# Altium project PCB_TCC.PrjPcb
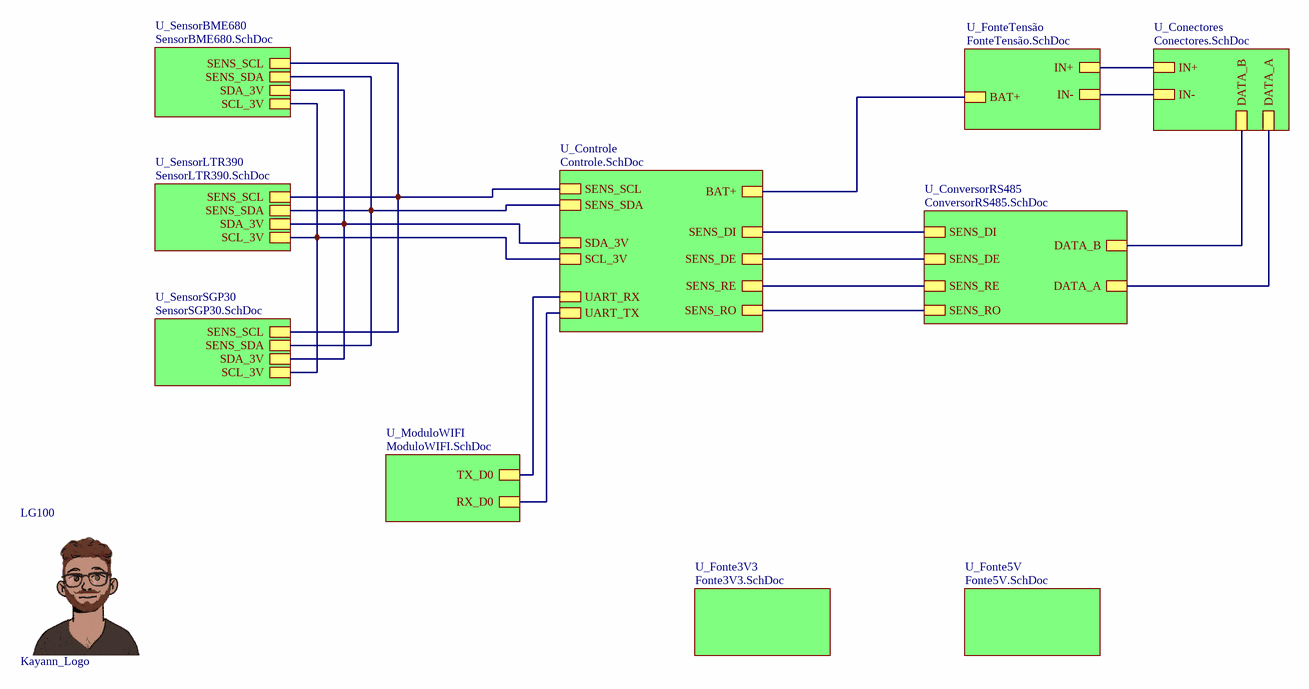
[diagram p0: AGRIsense.SchDoc]
CAGE_CODE: ?????; CONTRACT_NUMBER: <CONTRACT NO>; DOC_NO_ASSY_DWG: <ASSY DWG NO>; DOC_NO_BOM: <BOM DOC NO>; DOC_NO_FAB_DWG: <FAB DWG NO>; DOC_NO_SCH_DWG: <SCH DWG NO>; PCB_2_DEC_TOL: +/-.01; PCB_3_DEC_TOL: +/-.010; PCB_ANG_TOL: +/-1/2; PCB_ASSEMBLY_NO: <PCB ASSY NO>; PCB_CHECKER: - -----; PCB_CHECKER_APP_DATE: --/--/----; PCB_DESIGNER: - -----; PCB_DESIGNER_APP_DATE: --/--/----; PCB_DWG_NO: <PCB DWG NO>; PCB_ENGINEER: Kayann Soares; PCB_ENGINEER_APP_DATE: --/--/----; PCB_PART_NUMBER: <PCB PN>; PCB_REV: A; SCH_REV: A
11 sheets, 77 parts. Net scope: hierarchical (ports join the sheet entries above them; power ports are global).
Board file: PCB1.PcbDoc
Sheets:
  AGRIsense.SchDoc
    U_SensorSGP30 = SensorSGP30.SchDoc
    U_SensorLTR390 = SensorLTR390.SchDoc
    U_ModuloWIFI = ModuloWIFI.SchDoc
    U_Fonte3V3 = Fonte3V3.SchDoc
    U_Conectores = Conectores.SchDoc
    U_ConversorRS485 = ConversorRS485.SchDoc
    U_SensorBME680 = SensorBME680.SchDoc
    U_Fonte5V = Fonte5V.SchDoc
    U_Controle = Controle.SchDoc
    U_FonteTensão = FonteTensão.SchDoc

## Sheet AGRIsense.SchDoc
size A4; Engineer: Kayann Soares; SheetNumber: 1; SheetTotal: 11; CompanyInfo1: Universidade Federal do Ceará; CompanyInfo2: Centro de Tecnologia - CT; CompanyInfo3: Dep. de Eng. de Teleinformática

### Parts
LG100  Kayann_Logo  [Kayann_Logo]

### Sub-sheets
U_Conectores = Conectores.SchDoc: IN+, IN-, DATA_A, DATA_B
U_Controle = Controle.SchDoc: SENS_SCL, SENS_SDA, SDA_3V, SCL_3V, UART_RX, UART_TX, SENS_DI, SENS_DE, SENS_RE, SENS_RO, BAT+
U_ConversorRS485 = ConversorRS485.SchDoc: SENS_DI, SENS_DE, SENS_RE, SENS_RO, DATA_A, DATA_B
U_Fonte3V3 = Fonte3V3.SchDoc: no entries
U_Fonte5V = Fonte5V.SchDoc: no entries
U_FonteTensão = FonteTensão.SchDoc: IN+, IN-, BAT+
U_ModuloWIFI = ModuloWIFI.SchDoc: RX_D0, TX_D0
U_SensorBME680 = SensorBME680.SchDoc: SENS_SCL, SENS_SDA, SDA_3V, SCL_3V
U_SensorLTR390 = SensorLTR390.SchDoc: SENS_SCL, SENS_SDA, SDA_3V, SCL_3V
U_SensorSGP30 = SensorSGP30.SchDoc: SENS_SCL, SENS_SDA, SDA_3V, SCL_3V

### Nets
IN-: sheet U_Conectores/IN-, sheet U_FonteTensão/IN-
BAT+: sheet U_Controle/BAT+, sheet U_FonteTensão/BAT+
DATA_A: sheet U_Conectores/DATA_A, sheet U_ConversorRS485/DATA_A
DATA_B: sheet U_Conectores/DATA_B, sheet U_ConversorRS485/DATA_B
IN+: sheet U_Conectores/IN+, sheet U_FonteTensão/IN+
RX_D0: sheet U_ModuloWIFI/RX_D0, sheet U_Controle/UART_TX
SCL_3V: sheet U_SensorSGP30/SCL_3V, sheet U_SensorLTR390/SCL_3V, sheet U_SensorBME680/SCL_3V, sheet U_Controle/SCL_3V
SDA_3V: sheet U_SensorSGP30/SDA_3V, sheet U_SensorLTR390/SDA_3V, sheet U_SensorBME680/SDA_3V, sheet U_Controle/SDA_3V
SENS_DE: sheet U_ConversorRS485/SENS_DE, sheet U_Controle/SENS_DE
SENS_DI: sheet U_ConversorRS485/SENS_DI, sheet U_Controle/SENS_DI
SENS_RE: sheet U_ConversorRS485/SENS_RE, sheet U_Controle/SENS_RE
SENS_RO: sheet U_ConversorRS485/SENS_RO, sheet U_Controle/SENS_RO
SENS_SCL: sheet U_SensorSGP30/SENS_SCL, sheet U_SensorLTR390/SENS_SCL, sheet U_SensorBME680/SENS_SCL, sheet U_Controle/SENS_SCL
SENS_SDA: sheet U_SensorSGP30/SENS_SDA, sheet U_SensorLTR390/SENS_SDA, sheet U_SensorBME680/SENS_SDA, sheet U_Controle/SENS_SDA
TX_D0: sheet U_ModuloWIFI/TX_D0, sheet U_Controle/UART_RX

### Notes on the sheet
- Título:
- Padrão:
- Projeto:
- Eng. Responsável:
- A4
- Data:
- Versão:
- Folha:
- V1
- de
- Arquivo:

## Sheet SensorSGP30.SchDoc
size A4; Engineer: Kayann Soares; SheetNumber: 6; SheetTotal: 10; CompanyInfo1: Universidade Federal do Ceará; CompanyInfo2: Centro de Tecnologia - CT; CompanyInfo3: Dep. de Eng. de Teleinformática
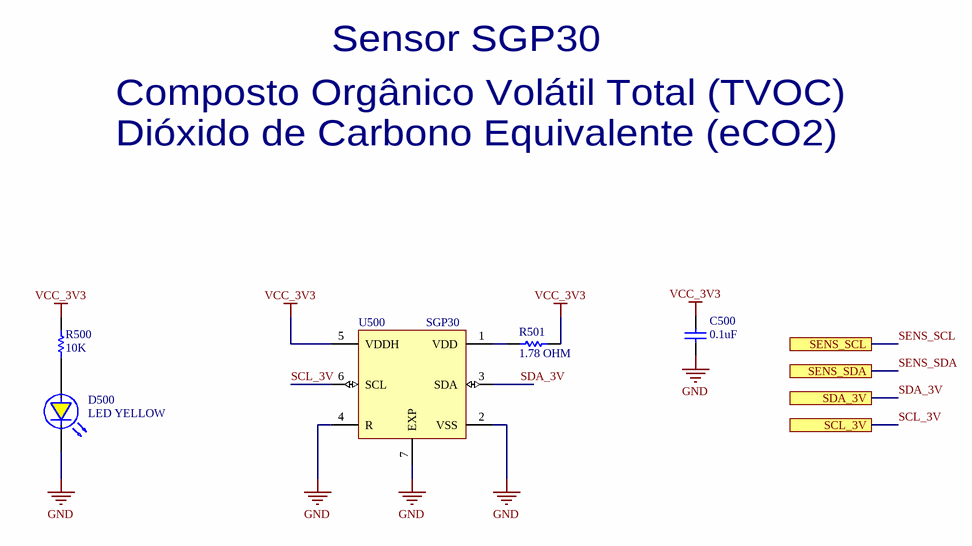
[diagram p1: SensorSGP30.SchDoc]

### Parts
C500  0.1uF  [CAP_CER_0603]
D500  LED YELLOW  [LED_YELLOW_SMD_0603]
R500  10K  [RES_0603]
R501  1.78 OHM  [RES_0603]
U500  SGP30  [SGP30]

### Ports
SCL_3V, SDA_3V, SENS_SCL, SENS_SDA

### Nets
GND: C500.1 D500.K U500.2(VSS) U500.4(R) U500.7(EXP)  [project net IN-]
VCC_3V3: C500.2 R500.2 R501.2 U500.5(VDDH)
SCL_3V: U500.6(SCL) ; port SCL_3V
SDA_3V: U500.3(SDA) ; port SDA_3V
NetD500_A: D500.A R500.1
NetR501_1: R501.1 U500.1(VDD)

### Notes on the sheet
- Sensor SGP30
- Composto Orgânico Volátil Total (TVOC)
- Dióxido de Carbono Equivalente (eCO2)
- Título:
- Padrão:
- Projeto:
- Eng. Responsável:
- A4
- Data:
- Versão:
- Folha:
- V1
- de
- Arquivo:

### Library data of the parts
C500 = CAP_CER_0.1uF_0603: Supplier 1: Digi-Key Marketplace; Supplier Part Number 1: 2571-GMC10X7R104J25NTTR-ND
D500 = LED_YELLOW_SMD_0603: Supplier 1: Digi-Key; Supplier Part Number 1: 754-1124-1-ND
R500 = RES_10K_0603: Supplier 1: Digi-Key Marketplace; Supplier Part Number 1: 2571-RM06J103CTTR-ND
R501 = RES_1.78OHM_0603: Supplier 1: Arrow Electronics; Supplier Part Number 1: RMCF0603FT1R78
U500 = SGP30: Supplier 1: Digi-Key; Supplier Part Number 1: 1649-1084-1-ND

## Sheet SensorLTR390.SchDoc
size A4; Engineer: Kayann Soares; SheetNumber: 5; SheetTotal: 10; CompanyInfo1: Universidade Federal do Ceará; CompanyInfo2: Centro de Tecnologia - CT; CompanyInfo3: Dep. de Eng. de Teleinformática
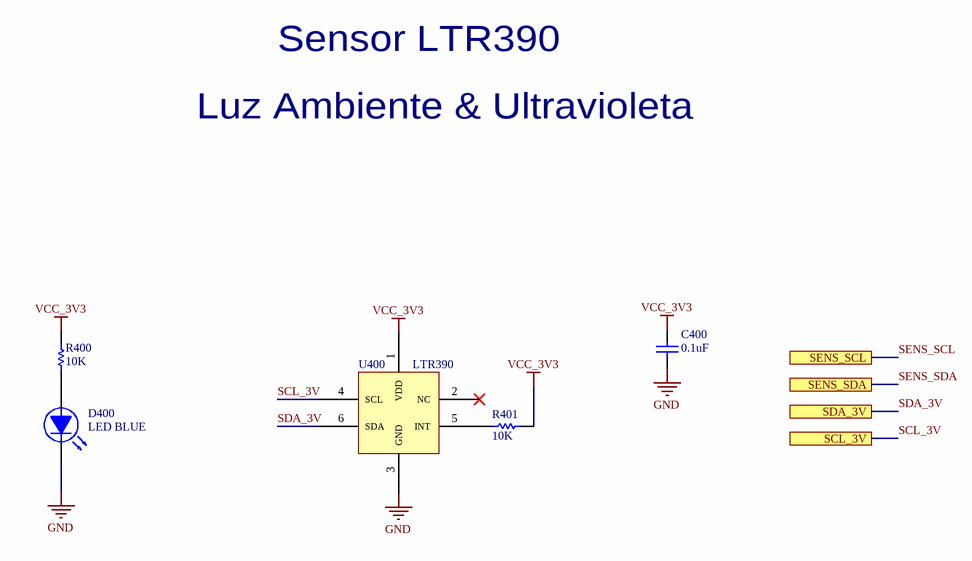
[diagram p2: SensorLTR390.SchDoc]

### Parts
C400  0.1uF  [CAP_CER_0603]
D400  LED BLUE  [LED_BLUE_SMD_0603]
R400  10K  [RES_0603]
R401  10K  [RES_0603]
U400  LTR390  [LTR390]

### Ports
SCL_3V, SDA_3V, SENS_SCL, SENS_SDA

### Nets
GND: C400.1 D400.K U400.3(GND)  [project net IN-]
VCC_3V3: C400.2 R400.2 R401.2 U400.1(VDD)
SCL_3V: U400.4(SCL) ; port SCL_3V
SDA_3V: U400.6(SDA) ; port SDA_3V
NetD400_A: D400.A R400.1
NetR401_1: R401.1 U400.5(INT)

Not connected (* = marked no-connect by the designer): U400 2(NC)*

### Notes on the sheet
- Sensor LTR390
- Luz Ambiente & Ultravioleta
- Título:
- Padrão:
- Projeto:
- Eng. Responsável:
- A4
- Data:
- Versão:
- Folha:
- V1
- de
- Arquivo:

### Library data of the parts
C400 = CAP_CER_0.1uF_0603: Supplier 1: Digi-Key Marketplace; Supplier Part Number 1: 2571-GMC10X7R104J25NTTR-ND
D400 = LED_BLUE_SMD_0603: ComponentLink1Description: New link; ComponentLink1URL: *; Supplier 1: Digi-Key; Supplier Part Number 1: 754-1434-1-ND
R400 R401 = RES_10K_0603: Supplier 1: Digi-Key Marketplace; Supplier Part Number 1: 2571-RM06J103CTTR-ND
U400 = LTR390: Supplier 1: Digi-Key; Supplier Part Number 1: LTR-390UV-01-ND

## Sheet ModuloWIFI.SchDoc
size A4; Engineer: Kayann Soares; SheetNumber: 3; SheetTotal: 11; CompanyInfo1: Universidade Federal do Ceará; CompanyInfo2: Centro de Tecnologia - CT; CompanyInfo3: Dep. de Eng. de Teleinformática
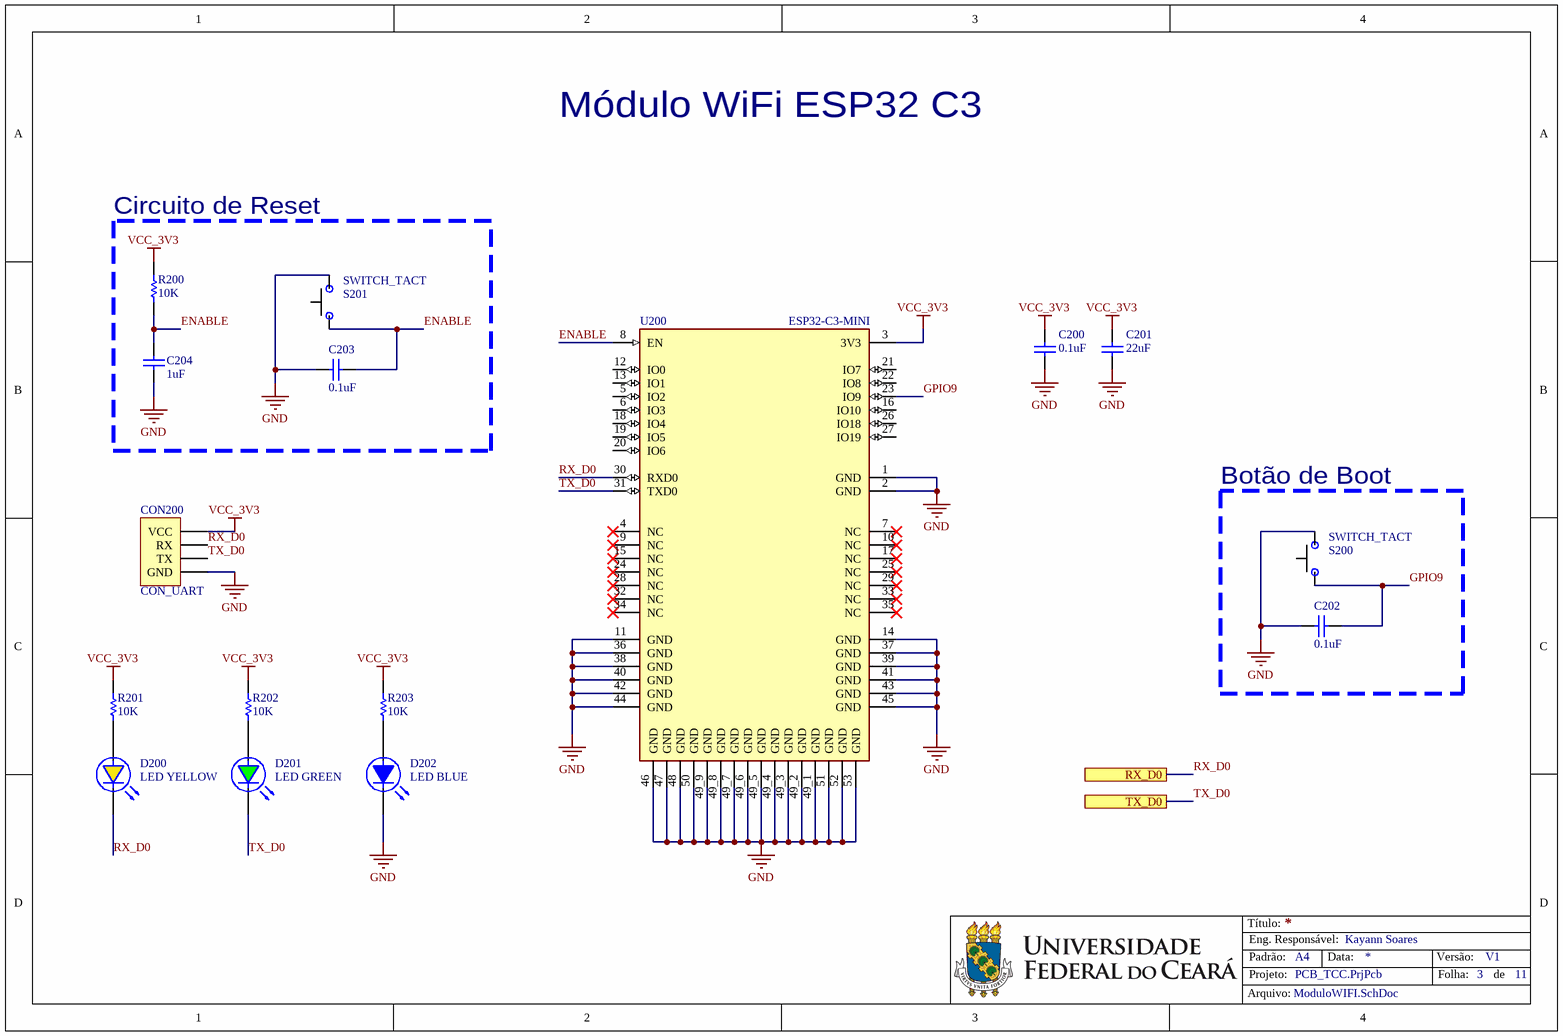
[diagram p3: ModuloWIFI.SchDoc]

### Parts
C200  0.1uF  [CAP_CER_0603]
C201  22uF  [CAP_CER_0603]
C202  0.1uF  [CAP_CER_0603]
C203  0.1uF  [CAP_CER_0603]
C204  1uF  [CAP_CER_0603]
CON200  CON_UART  [CON_UART]
D200  LED YELLOW  [LED_YELLOW_SMD_0603]
D201  LED GREEN  [LED_GREEN_SMD_0603]
D202  LED BLUE  [LED_BLUE_SMD_0603]
R200  10K  [RES_0603]
R201  10K  [RES_0603]
R202  10K  [RES_0603]
R203  10K  [RES_0603]
S200  SWITCH_TACT  [SWITCH_TACT_6.0x3.5]
S201  SWITCH_TACT  [SWITCH_TACT_6.0x3.5]
U200  ESP32-C3-MINI  [ESP32-C3-MINI]

### Blocks framed on the sheet
Botão de Boot: C202 S200

### Ports
RX_D0, TX_D0

### Nets
GND: C200.1 C201.1 C202.1 C203.1 C204.1 CON200.4(GND) D202.K S200.1 S201.1 U200.1(GND) U200.2(GND) U200.11(GND) U200.14(GND) U200.36(GND) U200.37(GND) U200.38(GND) U200.39(GND) U200.40(GND) U200.41(GND) U200.42(GND) U200.43(GND) U200.44(GND) U200.45(GND) U200.46(GND) U200.47(GND) U200.48(GND) U200.49_1(GND) U200.49_2(GND) U200.49_3(GND) U200.49_4(GND) U200.49_5(GND) U200.49_6(GND) U200.49_7(GND) U200.49_8(GND) U200.49_9(GND) U200.50(GND) U200.51(GND) U200.52(GND) U200.53(GND)  [project net IN-]
VCC_3V3: C200.2 C201.2 CON200.1(VCC) R200.2 R201.2 R202.2 R203.2 U200.3(3V3)
ENABLE: C203.2 C204.2 R200.1 S201.2 U200.8(EN)
GPIO9: C202.2 S200.2 U200.23(IO9)
RX_D0: CON200.2(RX) D200.K U200.30(RXD0) ; port RX_D0
TX_D0: CON200.3(TX) D201.K U200.31(TXD0) ; port TX_D0
NetD200_A: D200.A R201.1
NetD201_A: D201.A R202.1
NetD202_A: D202.A R203.1

Not connected (* = marked no-connect by the designer): U200 4(NC)* 5(IO2) 6(IO3) 7(NC)* 9(NC)* 10(NC)* 12(IO0) 13(IO1) 15(NC)* 16(IO10) 17(NC)* 18(IO4) 19(IO5) 20(IO6) 21(IO7) 22(IO8) 24(NC)* 25(NC)* 26(IO18) 27(IO19) 28(NC)* 29(NC)* 32(NC)* 33(NC)* 34(NC)* 35(NC)*

### Notes on the sheet
- Módulo WiFi ESP32 C3
- Circuito de Reset
- Título:
- Padrão:
- Projeto:
- Eng. Responsável:
- A4
- Data:
- Versão:
- Folha:
- V1
- de
- Arquivo:

### Library data of the parts
C200 C202 C203 = CAP_CER_0.1uF_0603: Supplier 1: Digi-Key Marketplace; Supplier Part Number 1: 2571-GMC10X7R104J25NTTR-ND
C201 = CAP_CER_22uF_0603: Supplier 1: Newark; Supplier Part Number 1: 03AC2653
C204 = CAP_CER_1uF_0603: Supplier 1: Arrow Electronics; Supplier Part Number 1: CL10B105KP8NNNC
D200 = LED_YELLOW_SMD_0603: Supplier 1: Digi-Key; Supplier Part Number 1: 754-1124-1-ND
D201 = LED_GREEN_SMD_0603: Supplier 1: Digi-Key; Supplier Part Number 1: 754-1121-1-ND
D202 = LED_BLUE_SMD_0603: ComponentLink1Description: New link; ComponentLink1URL: *; Supplier 1: Digi-Key; Supplier Part Number 1: 754-1434-1-ND
R200-R203 = RES_10K_0603: Supplier 1: Digi-Key Marketplace; Supplier Part Number 1: 2571-RM06J103CTTR-ND
S200 S201 = SWITCH_TACT_6.0x3.5: Supplier 1: Newark; Supplier Part Number 1: 35AH5169
U200 = ESP32-C3-MINI: Supplier 1: Mouser; Supplier Part Number 1: 356-ESP32-C3-MINI1H4

## Sheet Fonte3V3.SchDoc
size A4; Engineer: Kayann Soares; SheetNumber: 7; SheetTotal: 11; CompanyInfo1: Universidade Federal do Ceará; CompanyInfo2: Centro de Tecnologia - CT; CompanyInfo3: Dep. de Eng. de Teleinformática
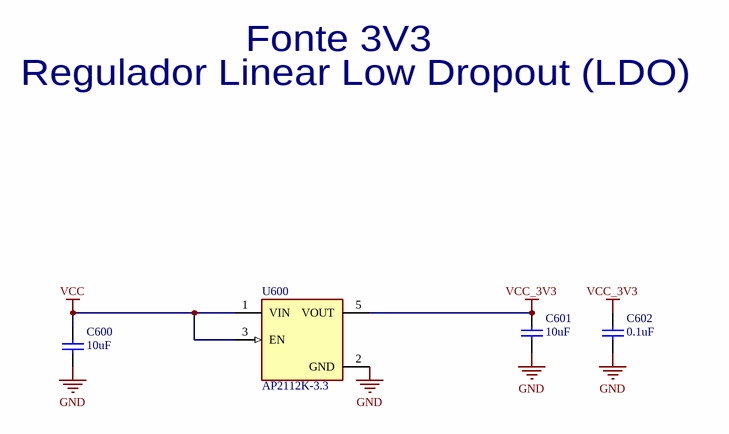
[diagram p4: Fonte3V3.SchDoc]

### Parts
C600  10uF  [CAP_CER_0805]
C601  10uF  [CAP_CER_0805]
C602  0.1uF  [CAP_CER_0603]
U600  AP2112K-3.3  [AP2112K-3.3]

### Nets
GND: C600.2 C601.2 C602.1 U600.2(GND)  [project net IN-]
VCC: C600.1 U600.1(VIN) U600.3(EN)
VCC_3V3: C601.1 C602.2 U600.5(VOUT)

### Notes on the sheet
- Fonte 3V3
- Regulador Linear Low Dropout (LDO)
- Título:
- Padrão:
- Projeto:
- Eng. Responsável:
- A4
- Data:
- Versão:
- Folha:
- V1
- de
- Arquivo:

### Library data of the parts
C600 C601 = CAP_CER_10uF_0805: Supplier 1: Arrow Electronics; Supplier Part Number 1: CL21A106KOQNNNE
C602 = CAP_CER_0.1uF_0603: Supplier 1: Digi-Key Marketplace; Supplier Part Number 1: 2571-GMC10X7R104J25NTTR-ND
U600 = AP2112K-3.3: Supplier 1: Future Electronics; Supplier Part Number 1: 8043011

## Sheet Conectores.SchDoc
size A4; Engineer: Kayann Soares; SheetNumber: 11; SheetTotal: 11; CompanyInfo1: Universidade Federal do Ceará; CompanyInfo2: Centro de Tecnologia - CT; CompanyInfo3: Dep. de Eng. de Teleinformática
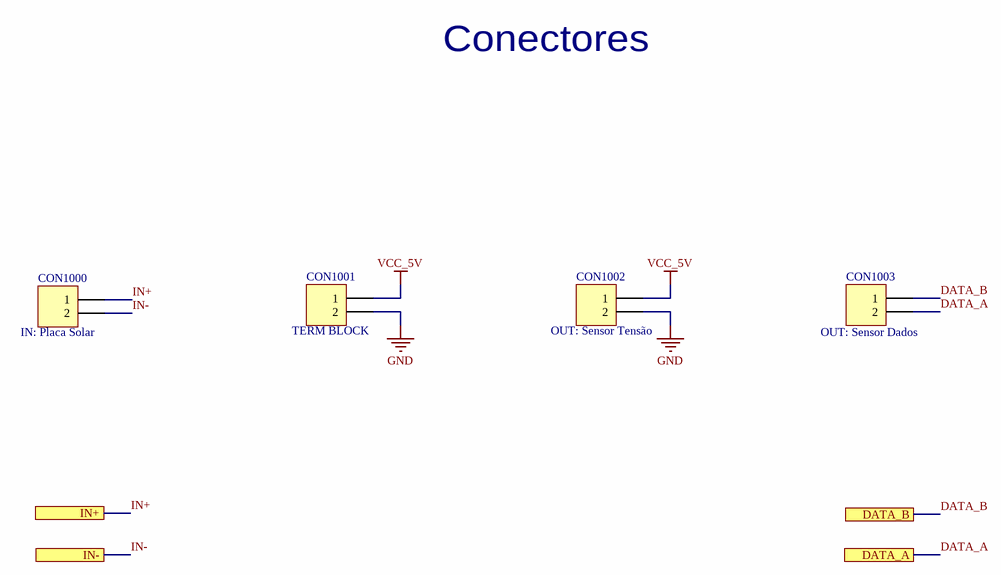
[diagram p5: Conectores.SchDoc]

### Parts
CON1000  IN: Placa Solar  [TERM BLOCK 2POS]
CON1001  TERM BLOCK  [TERM BLOCK 2POS]
CON1002  OUT: Sensor Tensão  [TERM BLOCK 2POS]
CON1003  OUT: Sensor Dados  [TERM BLOCK 2POS]

### Ports
DATA_A, DATA_B, IN+, IN-

### Nets
IN-: CON1000.2 CON1001.2 CON1002.2 ; port IN-  [also labelled GND]
VCC_5V: CON1001.1 CON1002.1
DATA_A: CON1003.2 ; port DATA_A
DATA_B: CON1003.1 ; port DATA_B
IN+: CON1000.1 ; port IN+

### Notes on the sheet
- Conectores
- Título:
- Padrão:
- Projeto:
- Eng. Responsável:
- A4
- Data:
- Versão:
- Folha:
- V1
- de
- Arquivo:

### Library data of the parts
CON1000-CON1003 = TERM BLOCK 2POS: Supplier 1: Newark; Supplier Part Number 1: 71C4161

## Sheet ConversorRS485.SchDoc
size A4; Engineer: Kayann Soares; SheetNumber: 10; SheetTotal: 11; CompanyInfo1: Universidade Federal do Ceará; CompanyInfo2: Centro de Tecnologia - CT; CompanyInfo3: Dep. de Eng. de Teleinformática
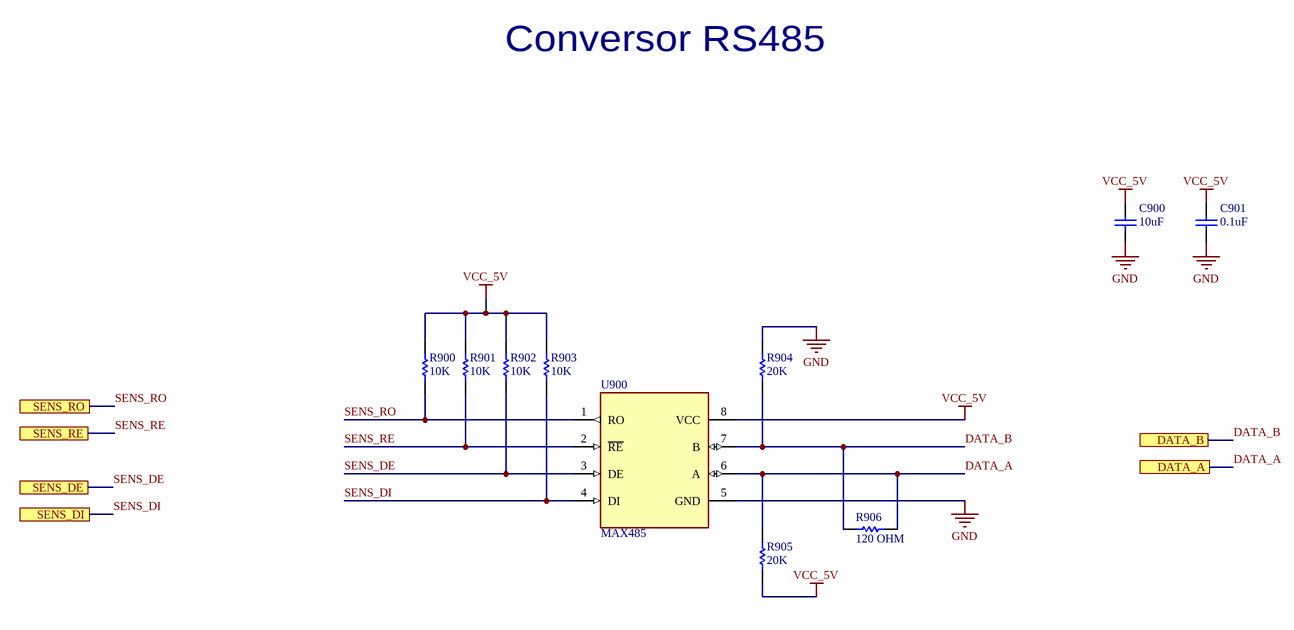
[diagram p6: ConversorRS485.SchDoc]

### Parts
C900  10uF  [CAP_CER_0805]
C901  0.1uF  [CAP_CER_0603]
R900  10K  [RES_0603]
R901  10K  [RES_0603]
R902  10K  [RES_0603]
R903  10K  [RES_0603]
R904  20K  [RES_0603]
R905  20K  [RES_0603]
R906  120 OHM  [RES_0603]
U900  MAX485  [MAX485]

### Ports
DATA_A, DATA_B, SENS_DE, SENS_DI, SENS_RE, SENS_RO

### Nets
GND: C900.2 C901.1 R904.2 U900.5(GND)  [project net IN-]
VCC_5V: C900.1 C901.2 R900.2 R901.2 R902.2 R903.2 R905.1 U900.8(VCC)
DATA_A: R905.2 R906.2 U900.6(A) ; port DATA_A
DATA_B: R904.1 R906.1 U900.7(B) ; port DATA_B
SENS_DE: R902.1 U900.3(DE) ; port SENS_DE
SENS_DI: R903.1 U900.4(DI) ; port SENS_DI
SENS_RE: R901.1 U900.2(~{RE}) ; port SENS_RE
SENS_RO: R900.1 U900.1(RO) ; port SENS_RO

### Notes on the sheet
- Conversor RS485
- Título:
- Padrão:
- Projeto:
- Eng. Responsável:
- A4
- Data:
- Versão:
- Folha:
- V1
- de
- Arquivo:

### Library data of the parts
C900 = CAP_CER_10uF_0805: Supplier 1: Arrow Electronics; Supplier Part Number 1: CL21A106KOQNNNE
C901 = CAP_CER_0.1uF_0603: Supplier 1: Digi-Key Marketplace; Supplier Part Number 1: 2571-GMC10X7R104J25NTTR-ND
R900-R903 = RES_10K_0603: Supplier 1: Digi-Key Marketplace; Supplier Part Number 1: 2571-RM06J103CTTR-ND
R904 R905 = RES_20K_0603: Supplier 1: Future Electronics; Supplier Part Number 1: 7472848
R906 = RES_120OHM_0603: Supplier 1: Future Electronics; Supplier Part Number 1: 7110726
U900 = MAX485: Supplier 1: Arrow Electronics; Supplier Part Number 1: MAX485ESA+T

## Sheet SensorBME680.SchDoc
size A4; Engineer: Kayann Soares; SheetNumber: 4; SheetTotal: 11; CompanyInfo1: Universidade Federal do Ceará; CompanyInfo2: Centro de Tecnologia - CT; CompanyInfo3: Dep. de Eng. de Teleinformática
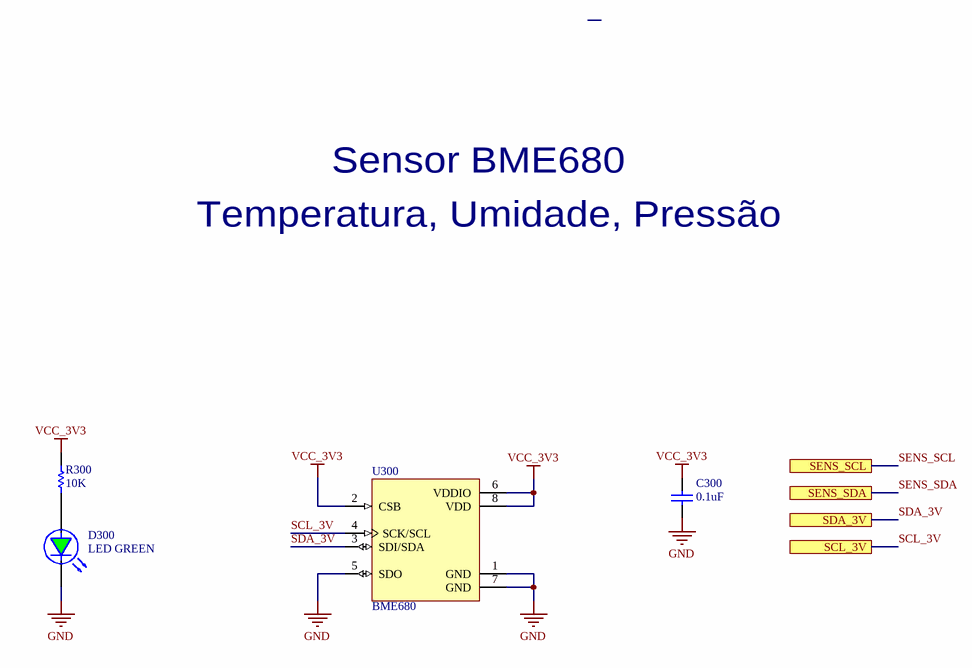
[diagram p7: SensorBME680.SchDoc]

### Parts
C300  0.1uF  [CAP_CER_0603]
D300  LED GREEN  [LED_GREEN_SMD_0603]
R300  10K  [RES_0603]
U300  BME680  [BME680]

### Ports
SCL_3V, SDA_3V, SENS_SCL, SENS_SDA

### Nets
GND: C300.1 D300.K U300.1(GND) U300.5(SDO) U300.7(GND)  [project net IN-]
VCC_3V3: C300.2 R300.2 U300.2(CSB) U300.6(VDDIO) U300.8(VDD)
SCL_3V: U300.4(SCK/SCL) ; port SCL_3V
SDA_3V: U300.3(SDI/SDA) ; port SDA_3V
NetD300_A: D300.A R300.1

### Notes on the sheet
- Sensor BME680
- Temperatura, Umidade, Pressão
- Título:
- Padrão:
- Projeto:
- Eng. Responsável:
- A4
- Data:
- Versão:
- Folha:
- V1
- de
- Arquivo:

### Library data of the parts
C300 = CAP_CER_0.1uF_0603: Supplier 1: Digi-Key Marketplace; Supplier Part Number 1: 2571-GMC10X7R104J25NTTR-ND
D300 = LED_GREEN_SMD_0603: Supplier 1: Digi-Key; Supplier Part Number 1: 754-1121-1-ND
R300 = RES_10K_0603: Supplier 1: Digi-Key Marketplace; Supplier Part Number 1: 2571-RM06J103CTTR-ND
U300 = BME680: Supplier 1: Digi-Key; Supplier Part Number 1: 828-1077-1-ND

## Sheet Fonte5V.SchDoc
size A4; Engineer: Kayann Soares; SheetNumber: 8; SheetTotal: 11; CompanyInfo1: Universidade Federal do Ceará; CompanyInfo2: Centro de Tecnologia - CT; CompanyInfo3: Dep. de Eng. de Teleinformática
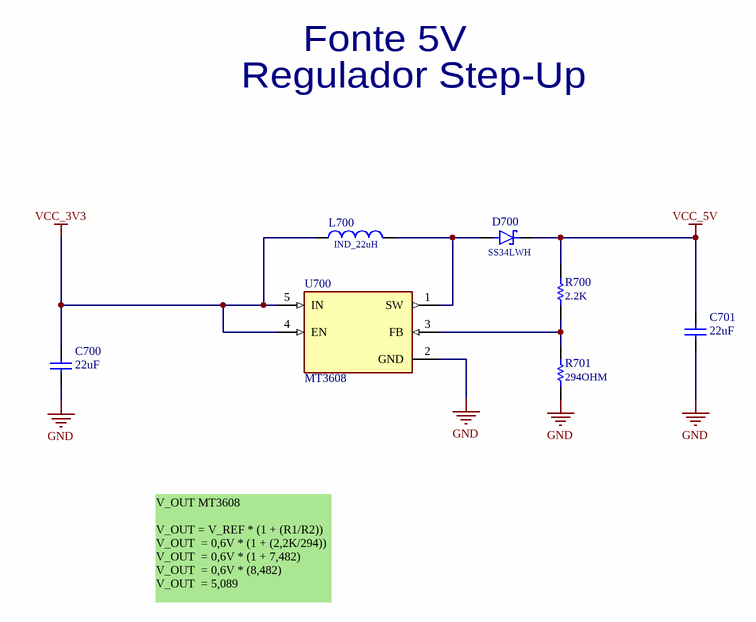
[diagram p8: Fonte5V.SchDoc]

### Parts
C700  22uF  [CAP_CER_0603]
C701  22uF  [CAP_CER_0603]
D700  SS34LWH  [DIODE_SS34LWH]
L700  IND_22uH  [FIXED_IND_22uH]
R700  2.2K  [RES_0603]
R701  294OHM
U700  MT3608  [MT3608]

### Nets
GND: C700.1 C701.1 R701.1 U700.2(GND)  [project net IN-]
VCC_3V3: C700.2 L700.1 U700.4(EN) U700.5(IN)
VCC_5V: C701.2 D700.C(K) R700.2
NetD700_A: D700.A L700.2 U700.1(SW)
NetR700_1: R700.1 R701.2 U700.3(FB)

### Notes on the sheet
- Fonte 5V
- Regulador Step-Up
- V_OUT MT3608
  V_OUT = V_REF * (1 + (R1/R2))
  V_OUT  = 0,6V * (1 + (2,2K/294))
  V_OUT  = 0,6V * (1 + 7,482)
  V_OUT  = 0,6V * (8,482)
  V_OUT  = 5,089
- Título:
- Padrão:
- Projeto:
- Eng. Responsável:
- A4
- Data:
- Versão:
- Folha:
- V1
- de
- Arquivo:

### Library data of the parts
C700 C701 = CAP_CER_22uF_0603: Supplier 1: Newark; Supplier Part Number 1: 03AC2653
D700 = DIODE_SS34LWH: Supplier 1: Mouser; Supplier Part Number 1: 821-SS34LWHRVG
L700 = FIXED_IND_22uH: Supplier 1: Newark; Supplier Part Number 1: 52K7553
R700 = RES_2.2K_0603: Supplier 1: Future Electronics; Supplier Part Number 1: 3379294
R701 = RES_294OHM_0603: Supplier 1: Future Electronics; Supplier Part Number 1: 1327384

## Sheet Controle.SchDoc
size A4; Engineer: Kayann Soares; SheetNumber: 2; SheetTotal: 11; CompanyInfo1: Universidade Federal do Ceará; CompanyInfo2: Centro de Tecnologia - CT; CompanyInfo3: Dep. de Eng. de Teleinformática
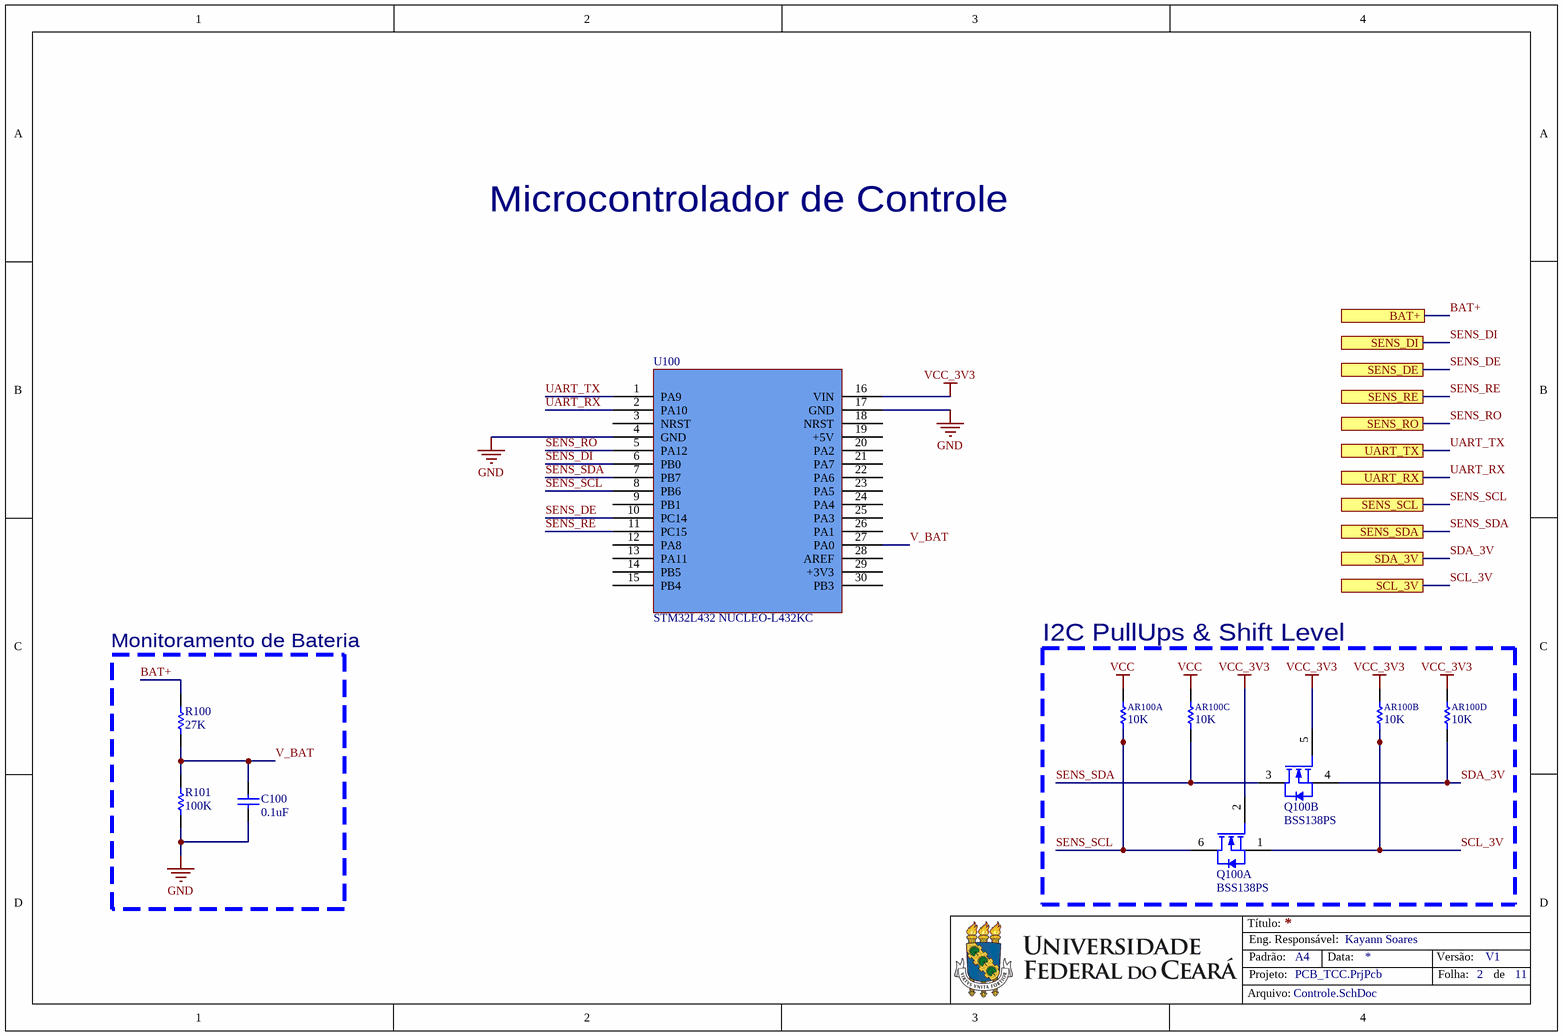
[diagram p9: Controle.SchDoc]

### Parts
AR100  10K  [RES_ARRAY _4RES_1206]  (parts A,B,C,D of 4)
C100  0.1uF  [CAP_CER_0603]
Q100  BSS138PS  [BSS138PS]  (parts A,B of 2)
R100  27K  [RES_0603]
R101  100K  [RES_0603]
U100  STM32L432 NUCLEO-L432KC  [STM32L432]

### Blocks framed on the sheet
Monitoramento de Bateria: C100 R100 R101
I2C PullUps & Shift Level: AR100 Q100

### Ports
BAT+, SCL_3V, SDA_3V, SENS_DE, SENS_DI, SENS_RE, SENS_RO, SENS_SCL, SENS_SDA, UART_RX, UART_TX

### Nets
GND: C100.1 R101.1 U100.4(GND) U100.17(GND)  [project net IN-]
VCC: AR100.6 AR100.8
VCC_3V3: AR100.5 AR100.7 Q100.2(G1) Q100.5(G2) U100.16(VIN)
BAT+: R100.2 ; port BAT+
SCL_3V: AR100.2 Q100.1(S1) ; port SCL_3V
SDA_3V: AR100.4 Q100.4(S2) ; port SDA_3V
SENS_DE: U100.10(PC14) ; port SENS_DE
SENS_DI: U100.6(PB0) ; port SENS_DI
SENS_RE: U100.11(PC15) ; port SENS_RE
SENS_RO: U100.5(PA12) ; port SENS_RO
SENS_SCL: AR100.1 Q100.6(D1) U100.8(PB6) ; port SENS_SCL
SENS_SDA: AR100.3 Q100.3(D2) U100.7(PB7) ; port SENS_SDA
UART_RX: U100.2(PA10) ; port UART_RX  [project net TX_D0]
UART_TX: U100.1(PA9) ; port UART_TX  [project net RX_D0]
V_BAT: C100.2 R100.1 R101.2 U100.27(PA0)

Not connected (* = marked no-connect by the designer): U100 3(NRST) 9(PB1) 12(PA8) 13(PA11) 14(PB5) 15(PB4) 18(NRST) 19(+5V) 20(PA2) 21(PA7) 22(PA6) 23(PA5) 24(PA4) 25(PA3) 26(PA1) 28(AREF) 29(+3V3) 30(PB3)

### Notes on the sheet
- Microcontrolador de Controle
- Título:
- Padrão:
- Projeto:
- Eng. Responsável:
- A4
- Data:
- Versão:
- Folha:
- V1
- de
- Arquivo:

### Library data of the parts
AR100 = RES_ARRAY_10K_1206: Supplier 1: Arrow Electronics; Supplier Part Number 1: CAY16-103J4LF
C100 = CAP_CER_0.1uF_0603: Supplier 1: Digi-Key Marketplace; Supplier Part Number 1: 2571-GMC10X7R104J25NTTR-ND
R100 = RES_27K_0603: Supplier 1: Future Electronics; Supplier Part Number 1: 6067715
R101 = RES_100K_0603: Supplier 1: Future Electronics; Supplier Part Number 1: 3697448
U100 = STM32L432
Q100 = BSS138PS: Supplier 1: Arrow Electronics; Supplier Part Number 1: BSS138PS,115

## Sheet FonteTensão.SchDoc
size A4; Engineer: Kayann Soares; SheetNumber: 9; SheetTotal: 11; CompanyInfo1: Universidade Federal do Ceará; CompanyInfo2: Centro de Tecnologia - CT; CompanyInfo3: Dep. de Eng. de Teleinformática
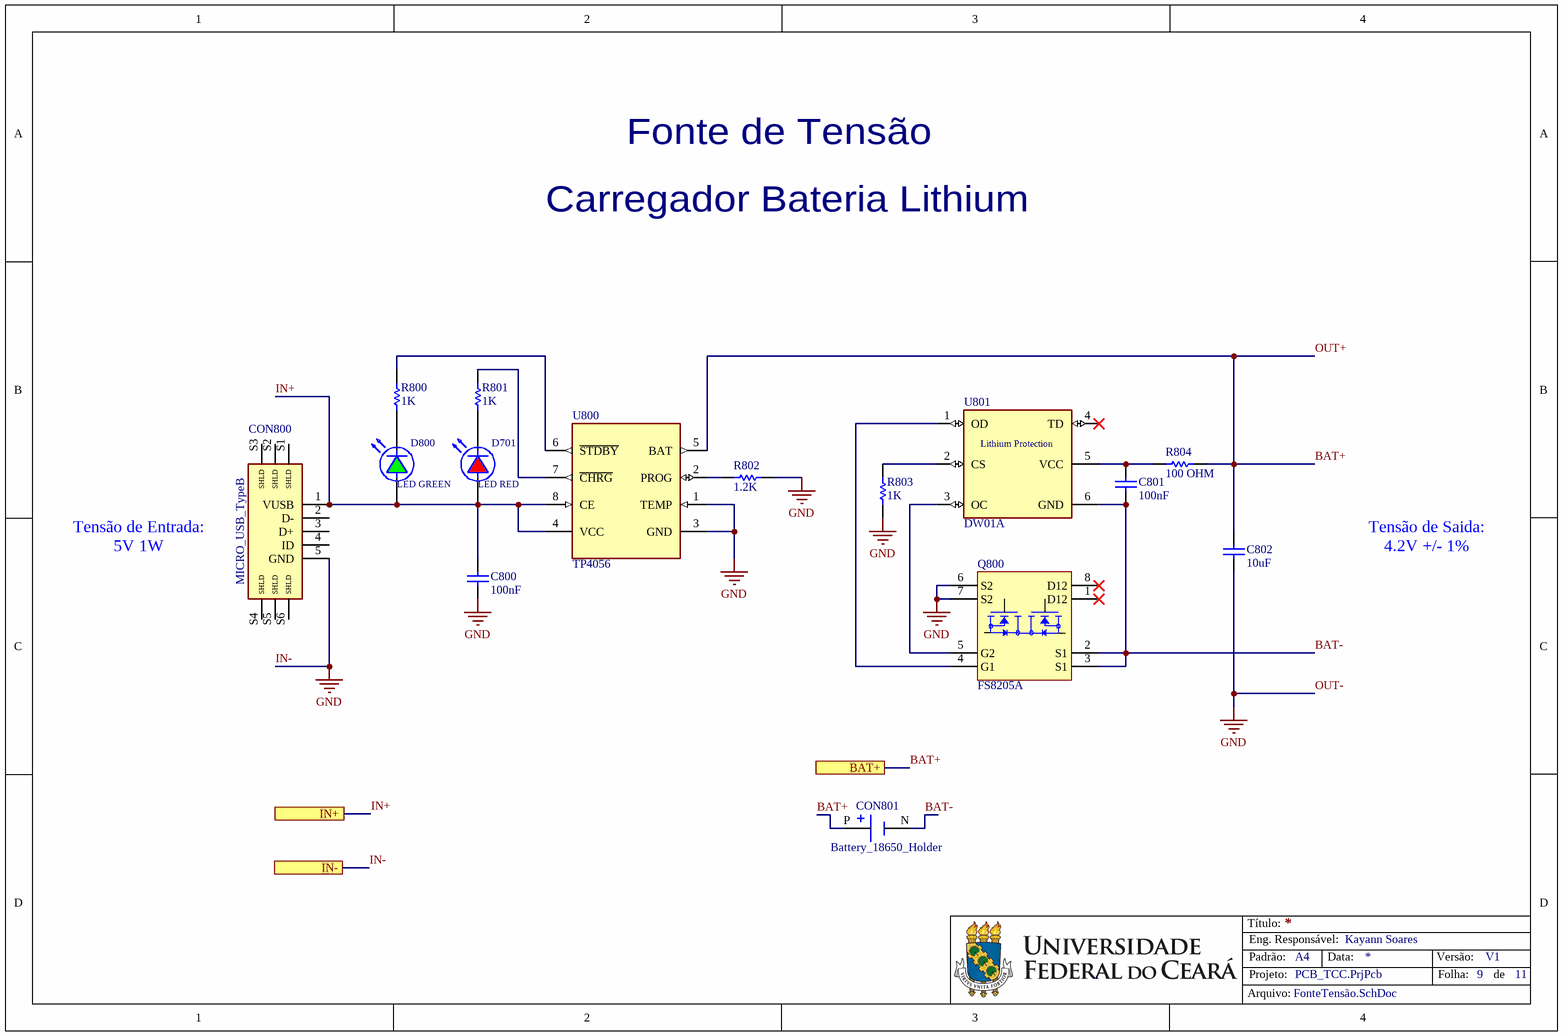
[diagram p10: FonteTensão.SchDoc]

### Parts
C800  100nF
C801  100nF
C802  10uF  [CAP_CER_0805]
CON800  MICRO_USB_TypeB  [MICRO_USB_TypeB]
CON801  Battery_18650_Holder  [Battery_18650_Holder]
D701  LED RED  [LED_RED_SMD_0603]
D800  LED GREEN  [LED_GREEN_SMD_0603]
Q800  FS8205A  [FS8205A]
R800  1K  [RES_0603]
R801  1K  [RES_0603]
R802  1.2K  [CAP_CER_0805]
R803  1K  [RES_0603]
R804  100 OHM  [RES_0603]
U800  TP4056  [TP4056]
U801  DW01A  [DW01A]

### Ports
BAT+, IN+, IN-

### Nets
IN-: C800.1 C802.1 CON800.5(GND) Q800.6(S2) Q800.7(S2) R802.2 R803.1 U800.1(TEMP) U800.3(GND) ; port IN-  [also labelled GND, OUT-]
BAT+: C802.2 CON801.P(POS) R804.2 U800.5(BAT) ; port BAT+  [also labelled OUT+]
BAT-: C801.1 CON801.N(NEG) Q800.2(S1) Q800.3(S1) U801.6(GND)
IN+: C800.2 CON800.1(VUSB) D701.A D800.A U800.4(VCC) U800.8(CE) ; port IN+
NetC801_2: C801.2 R804.1 U801.5(VCC)
NetD701_K: D701.K R801.1
NetD800_K: D800.K R800.1
NetQ800_4: Q800.4(G1) U801.1(OD)
NetQ800_5: Q800.5(G2) U801.3(OC)
NetR800_2: R800.2 U800.6(~{STDBY})
NetR801_2: R801.2 U800.7(~{CHRG})
NetR802_1: R802.1 U800.2(PROG)
NetR803_2: R803.2 U801.2(CS)

Not connected (* = marked no-connect by the designer): CON800 2(D-) 3(D+) 4(ID) S1(SHLD) S2(SHLD) S3(SHLD) S4(SHLD) S5(SHLD) S6(SHLD); Q800 1(D12)* 8(D12)*; U801 4(TD)*

### Notes on the sheet
- Fonte de Tensão
- Carregador Bateria Lithium
- (near CON800) Tensão de Entrada: 5V 1W
- Tensão de Saida: 4.2V +/- 1%
- Título:
- Padrão:
- Projeto:
- Eng. Responsável:
- A4
- Data:
- Versão:
- Folha:
- V1
- de
- Arquivo:
- (in symbol DW01A) Lithium Protection

### Library data of the parts
C800 C801 = CAP_CER_100nF_0603: Supplier 1: Arrow Electronics; Supplier Part Number 1: 02016C104KAT2A
C802 = CAP_CER_10uF_0805: Supplier 1: Arrow Electronics; Supplier Part Number 1: CL21A106KOQNNNE
D701 = LED_RED_SMD_0603: Supplier 1: Digi-Key; Supplier Part Number 1: 754-1117-1-ND
D800 = LED_GREEN_SMD_0603: Supplier 1: Digi-Key; Supplier Part Number 1: 754-1121-1-ND
R800 R801 R803 = RES_1K_0603: Supplier 1: Future Electronics; Supplier Part Number 1: 4016291
R802 = RES_1.2K_0805: Supplier 1: Newark; Supplier Part Number 1: 74AJ8198
R804 = RES_100OHM_0603: Supplier 1: Future Electronics; Supplier Part Number 1: 7334493
CON800 = MICRO_USB_TypeB: Supplier 1: Avnet; Supplier Part Number 1: 10118193-0001LF
U801 = DW01A: Supplier 1: LCSC; Supplier Part Number 1: C351410

## Nets that join several sheets
IN-: SensorSGP30 (5 pins), SensorLTR390 (C400.1 D400.K U400.3), ModuloWIFI (39 pins), Fonte3V3 (C600.2 C601.2 C602.1 U600.2), Conectores (CON1000.2 CON1001.2 CON1002.2), ConversorRS485 (C900.2 C901.1 R904.2 U900.5), SensorBME680 (5 pins), Fonte5V (C700.1 C701.1 R701.1 U700.2), Controle (C100.1 R101.1 U100.4 U100.17), FonteTensão (9 pins)
VCC: Fonte3V3 (C600.1 U600.1 U600.3), Controle (AR100.6 AR100.8)
VCC_3V3: SensorSGP30 (C500.2 R500.2 R501.2 U500.5), SensorLTR390 (C400.2 R400.2 R401.2 U400.1), ModuloWIFI (8 pins), Fonte3V3 (C601.1 C602.2 U600.5), SensorBME680 (5 pins), Fonte5V (C700.2 L700.1 U700.4 U700.5), Controle (5 pins)
VCC_5V: Conectores (CON1001.1 CON1002.1), ConversorRS485 (8 pins), Fonte5V (C701.2 D700.C R700.2)
BAT+: Controle (R100.2), FonteTensão (C802.2 CON801.P R804.2 U800.5)
DATA_A: Conectores (CON1003.2), ConversorRS485 (R905.2 R906.2 U900.6)
DATA_B: Conectores (CON1003.1), ConversorRS485 (R904.1 R906.1 U900.7)
IN+: Conectores (CON1000.1), FonteTensão (6 pins)
RX_D0: ModuloWIFI (CON200.2 D200.K U200.30), Controle (U100.1)
SCL_3V: SensorSGP30 (U500.6), SensorLTR390 (U400.4), SensorBME680 (U300.4), Controle (AR100.2 Q100.1)
SDA_3V: SensorSGP30 (U500.3), SensorLTR390 (U400.6), SensorBME680 (U300.3), Controle (AR100.4 Q100.4)
SENS_DE: ConversorRS485 (R902.1 U900.3), Controle (U100.10)
SENS_DI: ConversorRS485 (R903.1 U900.4), Controle (U100.6)
SENS_RE: ConversorRS485 (R901.1 U900.2), Controle (U100.11)
SENS_RO: ConversorRS485 (R900.1 U900.1), Controle (U100.5)
TX_D0: ModuloWIFI (CON200.3 D201.K U200.31), Controle (U100.2)